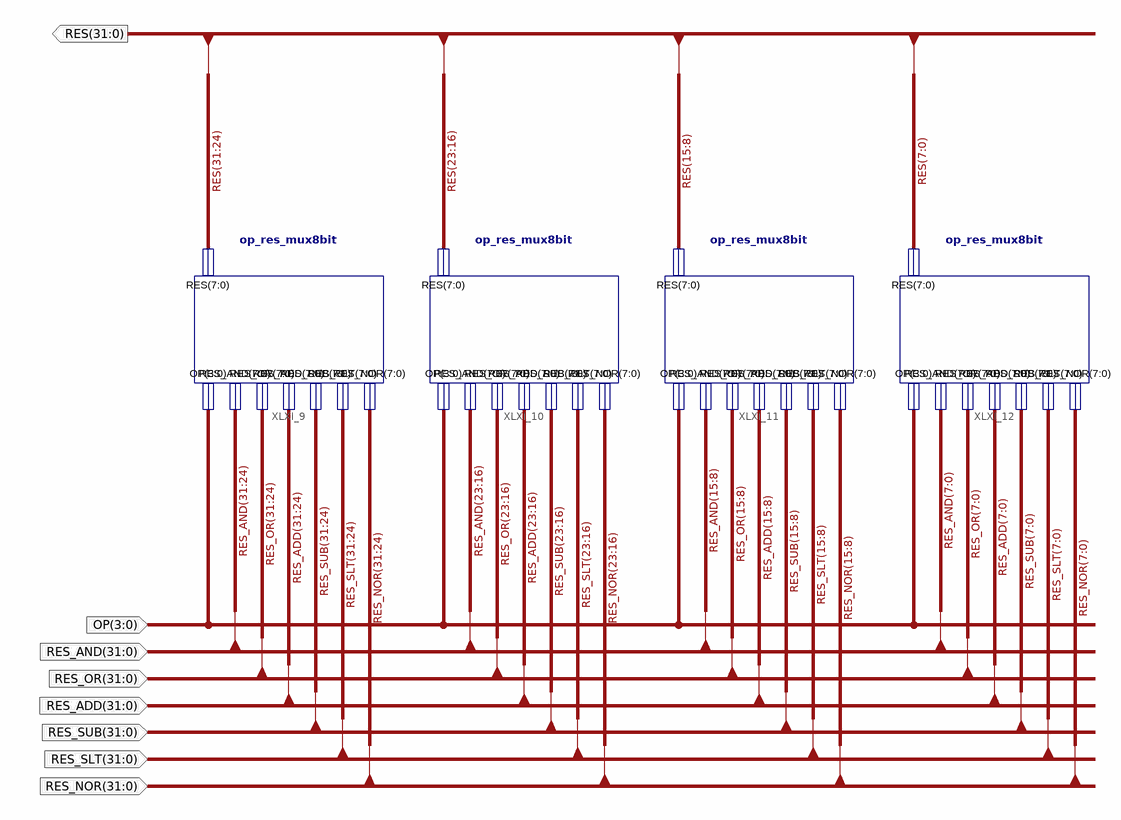
[diagram p0: schematic sheet 1]
// Xilinx ISE schematic op_res_mux32bit.sch (spartan3e) as structural Verilog: 4 symbols, 8 ports
module op_res_mux32bit (
  input  [3:0] OP,
  input  [31:0] RES_AND,
  input  [31:0] RES_OR,
  input  [31:0] RES_ADD,
  input  [31:0] RES_SUB,
  input  [31:0] RES_SLT,
  input  [31:0] RES_NOR,
  output [31:0] RES
);

  op_res_mux8bit XLXI_9 (
    .OP(OP), .RES_AND(RES_AND[31:24]), .RES_OR(RES_OR[31:24]), .RES_ADD(RES_ADD[31:24]),
    .RES_SUB(RES_SUB[31:24]), .RES_SLT(RES_SLT[31:24]), .RES_NOR(RES_NOR[31:24]), .RES(RES[31:24]));
  op_res_mux8bit XLXI_10 (
    .OP(OP), .RES_AND(RES_AND[23:16]), .RES_OR(RES_OR[23:16]), .RES_ADD(RES_ADD[23:16]),
    .RES_SUB(RES_SUB[23:16]), .RES_SLT(RES_SLT[23:16]), .RES_NOR(RES_NOR[23:16]), .RES(RES[23:16]));
  op_res_mux8bit XLXI_11 (
    .OP(OP), .RES_AND(RES_AND[15:8]), .RES_OR(RES_OR[15:8]), .RES_ADD(RES_ADD[15:8]),
    .RES_SUB(RES_SUB[15:8]), .RES_SLT(RES_SLT[15:8]), .RES_NOR(RES_NOR[15:8]), .RES(RES[15:8]));
  op_res_mux8bit XLXI_12 (
    .OP(OP), .RES_AND(RES_AND[7:0]), .RES_OR(RES_OR[7:0]), .RES_ADD(RES_ADD[7:0]), .RES_SUB(RES_SUB[7:0]),
    .RES_SLT(RES_SLT[7:0]), .RES_NOR(RES_NOR[7:0]), .RES(RES[7:0]));
endmodule
